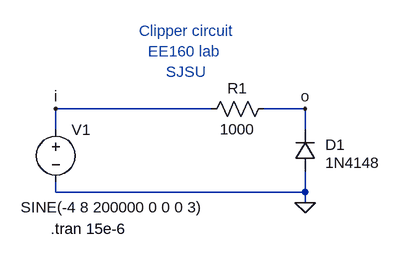
[diagram p0: schematic clipper.asc]
clipper.asc, the LTspice schematic file:
Version 4
SHEET 1 880 680
WIRE 224 128 -16 128
WIRE 368 128 304 128
WIRE -16 160 -16 128
WIRE 368 160 368 128
WIRE -16 256 -16 240
WIRE 368 256 368 224
WIRE 368 256 -16 256
WIRE 368 272 368 256
FLAG 368 272 0
FLAG 368 128 o
FLAG -16 128 i
SYMBOL res 320 112 R90
WINDOW 0 0 56 VBottom 2
WINDOW 3 32 56 VTop 2
SYMATTR InstName R1
SYMATTR Value 1000
SYMBOL diode 384 224 R180
WINDOW 0 -46 41 Left 2
WINDOW 3 -100 13 Left 2
SYMATTR InstName D1
SYMATTR Value 1N4148
SYMBOL voltage -16 144 R0
WINDOW 3 -54 135 Left 2
WINDOW 123 0 0 Left 0
WINDOW 39 0 0 Left 0
SYMATTR Value SINE(-4 8 200000 0 0 0 3)
SYMATTR InstName V1
TEXT -24 312 Left 2 !.tran 15e-6
TEXT 112 8 Left 2 ;Clipper circuit\n  EE160 lab\n      SJSU

The netlist it stands for:
* clipper.asc
R1 o i 1000
D1 0 o 1N4148
V1 i 0 SINE(-4 8 200000 0 0 0 3)
.model D D
.lib standard.dio
.tran 15e-6
* Clipper circuit
*   EE160 lab
*       SJSU
.backanno
.end